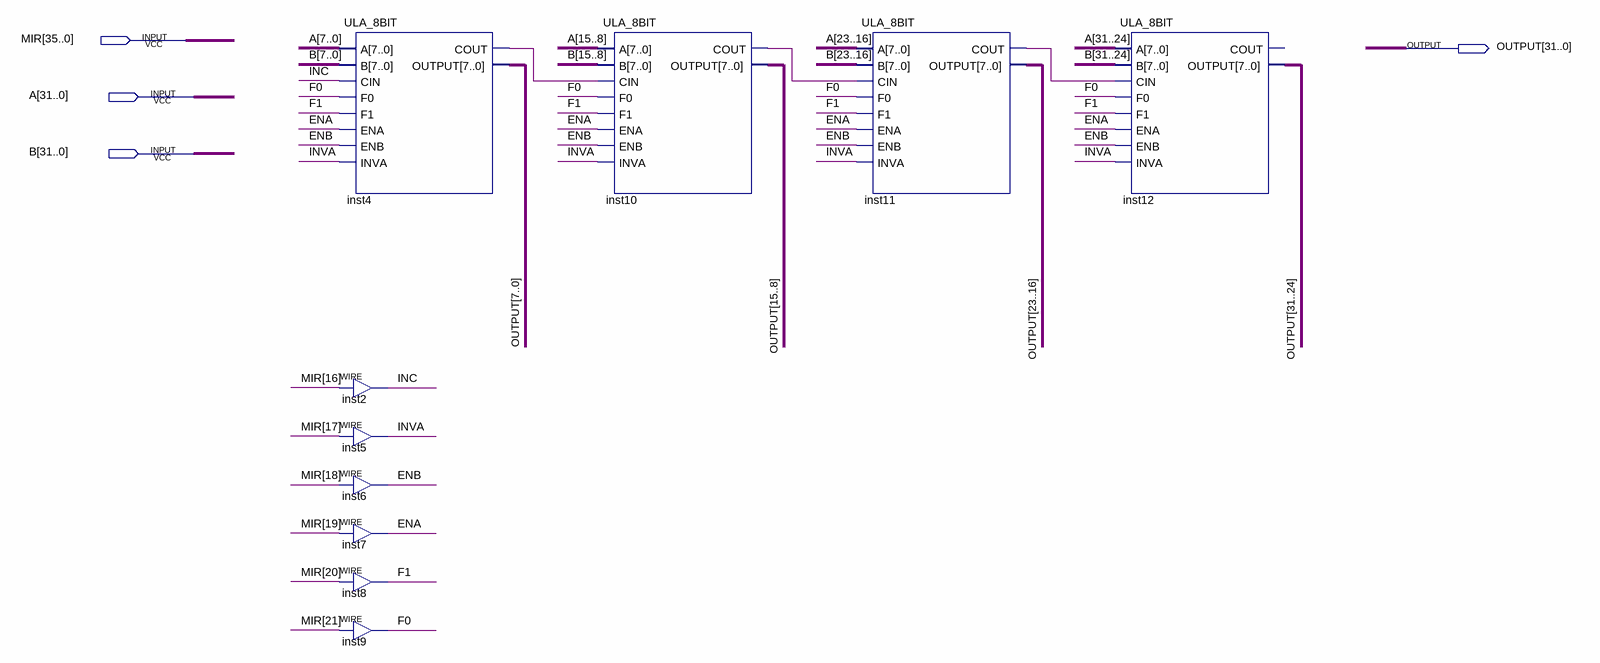
[diagram p0: schematic sheet]
// Quartus schematic ULA_32BITS.bdf as structural Verilog: 10 symbols, 4 pins
module ULA_32BITS (
  input  [35:0] MIR,
  input  [31:0] A,
  input  [31:0] B,
  output [31:0] OUTPUT
);

  wire ENA, ENB, F0, F1, INC, inst4_cout, inst10_cout, inst11_cout, INVA;

  ULA_8BIT inst4 (
    .A(A[7:0]), .B(B[7:0]), .CIN(INC), .F0(F0), .F1(F1), .ENA(ENA), .ENB(ENB), .INVA(INVA),
    .COUT(inst4_cout), .OUTPUT(OUTPUT[7:0]));
  assign INC = MIR[16];  // WIRE inst2
  assign INVA = MIR[17];  // WIRE inst5
  assign ENB = MIR[18];  // WIRE inst6
  assign ENA = MIR[19];  // WIRE inst7
  assign F1 = MIR[20];  // WIRE inst8
  assign F0 = MIR[21];  // WIRE inst9
  ULA_8BIT inst10 (
    .A(A[15:8]), .B(B[15:8]), .CIN(inst4_cout), .F0(F0), .F1(F1), .ENA(ENA), .ENB(ENB), .INVA(INVA),
    .COUT(inst10_cout), .OUTPUT(OUTPUT[15:8]));
  ULA_8BIT inst11 (
    .A(A[23:16]), .B(B[23:16]), .CIN(inst10_cout), .F0(F0), .F1(F1), .ENA(ENA), .ENB(ENB), .INVA(INVA),
    .COUT(inst11_cout), .OUTPUT(OUTPUT[23:16]));
  ULA_8BIT inst12 (
    .A(A[31:24]), .B(B[31:24]), .CIN(inst11_cout), .F0(F0), .F1(F1), .ENA(ENA), .ENB(ENB), .INVA(INVA),
    .OUTPUT(OUTPUT[31:24]));  // open: COUT
endmodule
